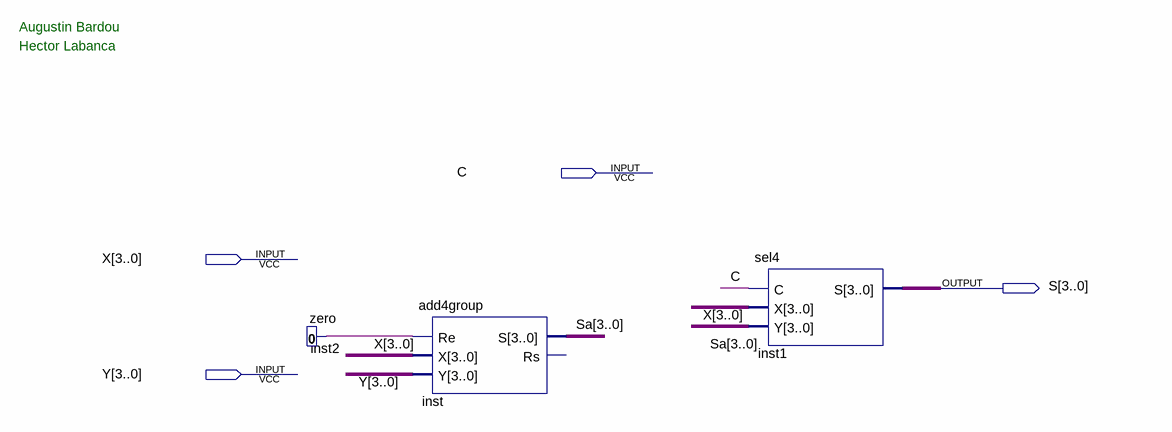
[diagram p0: schematic sheet]
// Quartus schematic question3_2.bdf as structural Verilog: 3 symbols, 4 pins
module question3_2 (
  input  C,
  input  [3:0] X,
  input  [3:0] Y,
  output [3:0] S
);

  wire inst2_0;
  wire [3:0] Sa;

  zero inst2 (.\0 (inst2_0));
  add4group inst (.Re(inst2_0), .X(X), .Y(Y), .S(Sa));  // open: Rs
  sel4 inst1 (.C(C), .X(X), .Y(Sa), .S(S));

  // Notes on the sheet:
  //   Augustin Bardou
  //   Hector Labanca
endmodule
